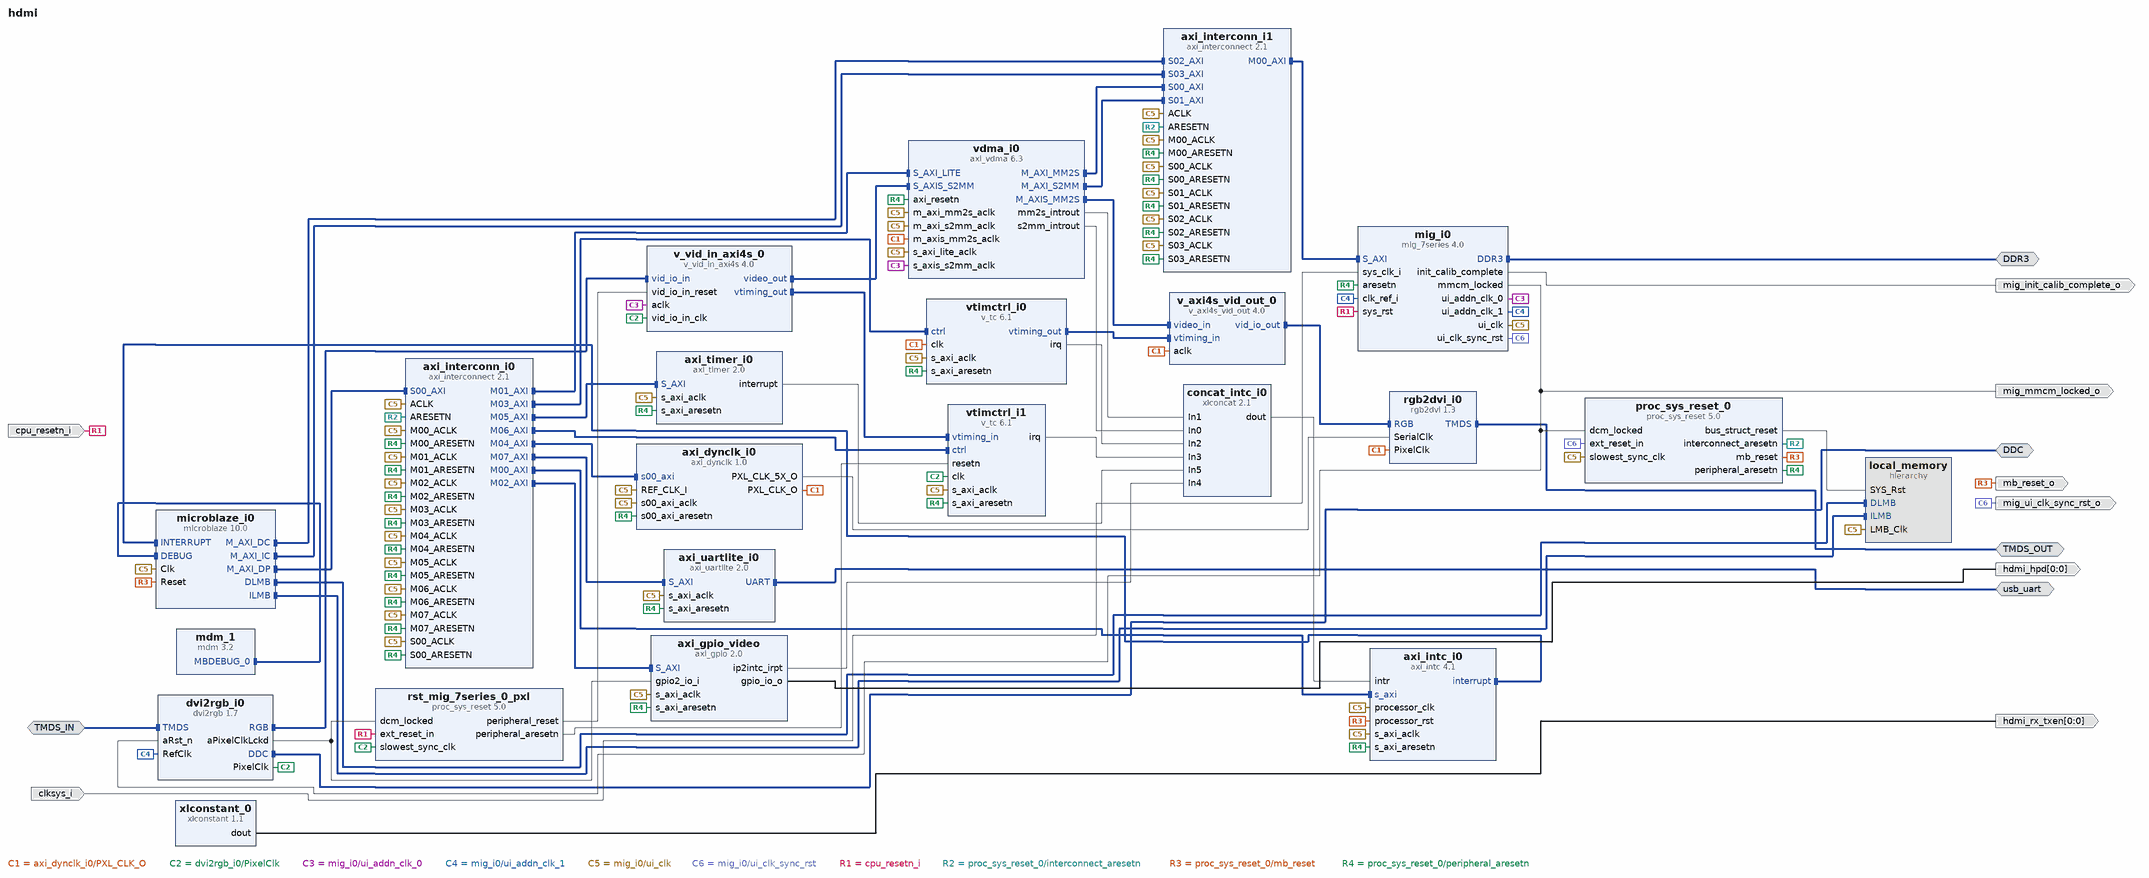
[diagram p0: block diagram of the top level]
# Vivado block design hdmi, xc7a200tsbg484-1, Vivado 2017.4
create_bd_design hdmi

create_bd_intf_port -mode Master -vlnv xilinx.com:interface:iic_rtl:1.0 DDC
create_bd_intf_port -mode Master -vlnv xilinx.com:interface:ddrx_rtl:1.0 DDR3
create_bd_intf_port -mode Slave -vlnv digilentinc.com:interface:tmds_rtl:1.0 TMDS_IN
create_bd_intf_port -mode Master -vlnv digilentinc.com:interface:tmds_rtl:1.0 TMDS_OUT
create_bd_intf_port -mode Master -vlnv xilinx.com:interface:uart_rtl:1.0 usb_uart
create_bd_port -dir O -from 0 -to 0 hdmi_hpd
create_bd_port -dir I -type rst cpu_resetn_i
set_property -dict {CONFIG.POLARITY ACTIVE_LOW} [get_bd_ports cpu_resetn_i]
create_bd_port -dir I -type clk clksys_i
set_property -dict {CONFIG.FREQ_HZ 200000000 CONFIG.PHASE 0.0 CONFIG.CLK_DOMAIN /clk_wiz_0_clk_out1} [get_bd_ports clksys_i]
create_bd_port -dir O -from 0 -to 0 hdmi_rx_txen
create_bd_port -dir O mb_reset_o
create_bd_port -dir O mig_ui_clk_sync_rst_o
create_bd_port -dir O mig_mmcm_locked_o
create_bd_port -dir O mig_init_calib_complete_o

create_bd_cell -type hier local_memory
create_bd_cell -type ip -vlnv digilentinc.com:ip:axi_dynclk:1.0 axi_dynclk_i0
set_property -dict {CONFIG.ADD_BUFMR true} [get_bd_cells axi_dynclk_i0]
create_bd_cell -type ip -vlnv digilentinc.com:ip:dvi2rgb:1.7 dvi2rgb_i0
set_property -dict {CONFIG.kRstActiveHigh false CONFIG.kClkRange 2 CONFIG.kAddBUFG false} [get_bd_cells dvi2rgb_i0]
create_bd_cell -type ip -vlnv digilentinc.com:ip:rgb2dvi:1.3 rgb2dvi_i0
set_property -dict {CONFIG.kRstActiveHigh false CONFIG.kGenerateSerialClk false CONFIG.kClkRange 2} [get_bd_cells rgb2dvi_i0]
create_bd_cell -type ip -vlnv xilinx.com:ip:axi_gpio:2.0 axi_gpio_video
set_property -dict [list \
  CONFIG.C_GPIO_WIDTH 1 \
  CONFIG.C_GPIO2_WIDTH 1 \
  CONFIG.C_IS_DUAL 1 \
  CONFIG.C_ALL_INPUTS_2 1 \
  CONFIG.C_INTERRUPT_PRESENT 1 \
  CONFIG.USE_BOARD_FLOW true \
  CONFIG.GPIO_BOARD_INTERFACE Custom \
  CONFIG.C_ALL_OUTPUTS 1 \
] [get_bd_cells axi_gpio_video]
create_bd_cell -type ip -vlnv xilinx.com:ip:axi_interconnect:2.1 axi_interconn_i1
set_property -dict [list \
  CONFIG.NUM_SI 4 \
  CONFIG.NUM_MI 1 \
  CONFIG.SYNCHRONIZATION_STAGES 2 \
  CONFIG.M00_HAS_REGSLICE 4 \
  CONFIG.M00_HAS_DATA_FIFO 0 \
  CONFIG.S00_HAS_REGSLICE 4 \
  CONFIG.S01_HAS_REGSLICE 4 \
  CONFIG.S02_HAS_REGSLICE 4 \
  CONFIG.S03_HAS_REGSLICE 4 \
  CONFIG.S00_HAS_DATA_FIFO 0 \
  CONFIG.S01_HAS_DATA_FIFO 0 \
  CONFIG.S02_HAS_DATA_FIFO 0 \
  CONFIG.S03_HAS_DATA_FIFO 0 \
] [get_bd_cells axi_interconn_i1]
create_bd_cell -type ip -vlnv xilinx.com:ip:axi_timer:2.0 axi_timer_i0
create_bd_cell -type ip -vlnv xilinx.com:ip:axi_uartlite:2.0 axi_uartlite_i0
set_property -dict [list \
  CONFIG.C_BAUDRATE 115200 \
  CONFIG.USE_BOARD_FLOW true \
  CONFIG.UARTLITE_BOARD_INTERFACE usb_uart \
] [get_bd_cells axi_uartlite_i0]
create_bd_cell -type ip -vlnv xilinx.com:ip:axi_vdma:6.3 vdma_i0
set_property -dict [list \
  CONFIG.c_m_axi_mm2s_data_width 128 \
  CONFIG.c_m_axis_mm2s_tdata_width 24 \
  CONFIG.c_m_axi_s2mm_data_width 128 \
  CONFIG.c_include_s2mm_dre 0 \
  CONFIG.c_mm2s_genlock_mode 0 \
  CONFIG.c_s2mm_genlock_mode 0 \
  CONFIG.c_mm2s_linebuffer_depth 4096 \
  CONFIG.c_s2mm_linebuffer_depth 4096 \
  CONFIG.c_mm2s_max_burst_length 32 \
  CONFIG.c_s2mm_max_burst_length 32 \
  CONFIG.c_include_s2mm 1 \
  CONFIG.c_addr_width 32 \
] [get_bd_cells vdma_i0]
create_bd_cell -type ip -vlnv xilinx.com:ip:mdm:3.2 mdm_1
create_bd_cell -type ip -vlnv xilinx.com:ip:microblaze:10.0 microblaze_i0
set_property -dict [list \
  CONFIG.C_D_AXI 1 \
  CONFIG.C_D_LMB 1 \
  CONFIG.C_I_LMB 1 \
  CONFIG.C_ENABLE_DISCRETE_PORTS 0 \
  CONFIG.G_TEMPLATE_LIST 2 \
  CONFIG.G_USE_EXCEPTIONS 1 \
  CONFIG.C_USE_MSR_INSTR 1 \
  CONFIG.C_USE_PCMP_INSTR 1 \
  CONFIG.C_USE_REORDER_INSTR 1 \
  CONFIG.C_USE_BARREL 1 \
  CONFIG.C_USE_DIV 1 \
  CONFIG.C_USE_HW_MUL 2 \
  CONFIG.C_USE_FPU 2 \
  CONFIG.C_DEBUG_ENABLED 2 \
  CONFIG.C_DEBUG_COUNTER_WIDTH 32 \
  CONFIG.C_USE_ICACHE 1 \
  CONFIG.C_CACHE_BYTE_SIZE 32768 \
  CONFIG.C_ICACHE_LINE_LEN 8 \
  CONFIG.C_ICACHE_VICTIMS 8 \
  CONFIG.C_ICACHE_STREAMS 1 \
  CONFIG.C_ICACHE_DATA_WIDTH 1 \
  CONFIG.C_USE_DCACHE 1 \
  CONFIG.C_DCACHE_BYTE_SIZE 32768 \
  CONFIG.C_DCACHE_LINE_LEN 8 \
  CONFIG.C_DCACHE_USE_WRITEBACK 1 \
  CONFIG.C_DCACHE_VICTIMS 8 \
  CONFIG.C_DCACHE_DATA_WIDTH 1 \
  CONFIG.C_USE_BRANCH_TARGET_CACHE 0 \
] [get_bd_cells microblaze_i0]
create_bd_cell -type ip -vlnv xilinx.com:ip:axi_intc:4.1 axi_intc_i0
set_property -dict {CONFIG.C_HAS_FAST 1} [get_bd_cells axi_intc_i0]
create_bd_cell -type ip -vlnv xilinx.com:ip:axi_interconnect:2.1 axi_interconn_i0
set_property -dict {CONFIG.NUM_MI 8 CONFIG.SYNCHRONIZATION_STAGES 2} [get_bd_cells axi_interconn_i0]
create_bd_cell -type ip -vlnv xilinx.com:ip:xlconcat:2.1 concat_intc_i0
set_property -dict {CONFIG.NUM_PORTS 6 CONFIG.dout_width 6} [get_bd_cells concat_intc_i0]
create_bd_cell -type ip -vlnv xilinx.com:ip:mig_7series:4.0 mig_i0
set_property -dict [list \
  CONFIG.XML_INPUT_FILE mig_b.prj \
  CONFIG.RESET_BOARD_INTERFACE reset \
  CONFIG.MIG_DONT_TOUCH_PARAM Custom \
  CONFIG.BOARD_MIG_PARAM Custom \
] [get_bd_cells mig_i0]
create_bd_cell -type ip -vlnv xilinx.com:ip:proc_sys_reset:5.0 rst_mig_7series_0_pxl
set_property -dict [list \
  CONFIG.C_AUX_RESET_HIGH 0 \
  CONFIG.USE_BOARD_FLOW true \
  CONFIG.RESET_BOARD_INTERFACE Custom \
] [get_bd_cells rst_mig_7series_0_pxl]
create_bd_cell -type ip -vlnv xilinx.com:ip:v_axi4s_vid_out:4.0 v_axi4s_vid_out_0
set_property -dict [list \
  CONFIG.C_S_AXIS_VIDEO_FORMAT 2 \
  CONFIG.C_S_AXIS_VIDEO_DATA_WIDTH 8 \
  CONFIG.C_ADDR_WIDTH 5 \
  CONFIG.C_VTG_MASTER_SLAVE 1 \
] [get_bd_cells v_axi4s_vid_out_0]
create_bd_cell -type ip -vlnv xilinx.com:ip:v_tc:6.1 vtimctrl_i0
set_property -dict {CONFIG.enable_detection false} [get_bd_cells vtimctrl_i0]
create_bd_cell -type ip -vlnv xilinx.com:ip:v_tc:6.1 vtimctrl_i1
set_property -dict [list \
  CONFIG.HAS_INTC_IF true \
  CONFIG.max_lines_per_frame 2048 \
  CONFIG.horizontal_blank_detection false \
  CONFIG.enable_generation false \
  CONFIG.vertical_blank_detection false \
] [get_bd_cells vtimctrl_i1]
create_bd_cell -type ip -vlnv xilinx.com:ip:v_vid_in_axi4s:4.0 v_vid_in_axi4s_0
set_property -dict {CONFIG.C_HAS_ASYNC_CLK 1 CONFIG.C_ADDR_WIDTH 5} [get_bd_cells v_vid_in_axi4s_0]
create_bd_cell -type ip -vlnv xilinx.com:ip:xlconstant:1.1 xlconstant_0
create_bd_cell -type ip -vlnv xilinx.com:ip:proc_sys_reset:5.0 proc_sys_reset_0

# ---- hierarchy /local_memory ----
current_bd_instance /local_memory
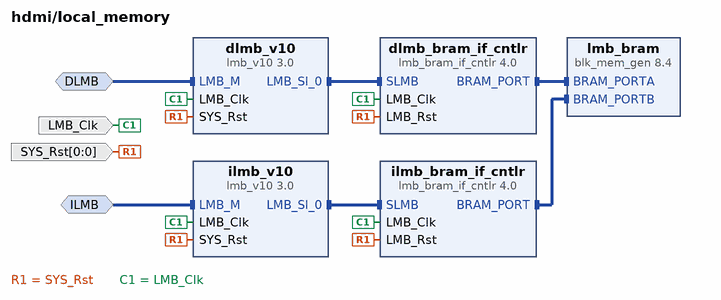
[diagram p1: block diagram inside /local_memory]
create_bd_intf_pin -mode MirroredMaster -vlnv xilinx.com:interface:lmb_rtl:1.0 DLMB
create_bd_intf_pin -mode MirroredMaster -vlnv xilinx.com:interface:lmb_rtl:1.0 ILMB
create_bd_pin -dir I -type clk LMB_Clk
create_bd_pin -dir I -from 0 -to 0 -type rst SYS_Rst

create_bd_cell -type ip -vlnv xilinx.com:ip:lmb_v10:3.0 dlmb_v10
create_bd_cell -type ip -vlnv xilinx.com:ip:lmb_v10:3.0 ilmb_v10
create_bd_cell -type ip -vlnv xilinx.com:ip:lmb_bram_if_cntlr:4.0 dlmb_bram_if_cntlr
set_property -dict {CONFIG.C_ECC 0} [get_bd_cells dlmb_bram_if_cntlr]
create_bd_cell -type ip -vlnv xilinx.com:ip:lmb_bram_if_cntlr:4.0 ilmb_bram_if_cntlr
set_property -dict {CONFIG.C_ECC 0} [get_bd_cells ilmb_bram_if_cntlr]
create_bd_cell -type ip -vlnv xilinx.com:ip:blk_mem_gen:8.4 lmb_bram
set_property -dict [list \
  CONFIG.Memory_Type True_Dual_Port_RAM \
  CONFIG.Enable_B Use_ENB_Pin \
  CONFIG.Use_RSTB_Pin true \
  CONFIG.Port_B_Clock 100 \
  CONFIG.Port_B_Write_Rate 50 \
  CONFIG.Port_B_Enable_Rate 100 \
  CONFIG.use_bram_block BRAM_Controller \
  CONFIG.EN_SAFETY_CKT false \
] [get_bd_cells lmb_bram]

# ---- connections ----

current_bd_instance /local_memory
connect_bd_intf_net -intf_net microblaze_0_dlmb_bus [get_bd_intf_pins dlmb_bram_if_cntlr/SLMB] [get_bd_intf_pins dlmb_v10/LMB_Sl_0]
connect_bd_intf_net -intf_net microblaze_0_dlmb_cntlr [get_bd_intf_pins dlmb_bram_if_cntlr/BRAM_PORT] [get_bd_intf_pins lmb_bram/BRAM_PORTA]
connect_bd_intf_net -intf_net microblaze_0_ilmb_bus [get_bd_intf_pins ilmb_bram_if_cntlr/SLMB] [get_bd_intf_pins ilmb_v10/LMB_Sl_0]
connect_bd_intf_net -intf_net microblaze_0_ilmb_cntlr [get_bd_intf_pins ilmb_bram_if_cntlr/BRAM_PORT] [get_bd_intf_pins lmb_bram/BRAM_PORTB]
connect_bd_intf_net -intf_net microblaze_0_dlmb [get_bd_intf_pins DLMB] [get_bd_intf_pins dlmb_v10/LMB_M]
connect_bd_intf_net -intf_net microblaze_0_ilmb [get_bd_intf_pins ILMB] [get_bd_intf_pins ilmb_v10/LMB_M]
connect_bd_net [get_bd_pins SYS_Rst] \
  [get_bd_pins dlmb_v10/SYS_Rst] [get_bd_pins ilmb_v10/SYS_Rst] [get_bd_pins dlmb_bram_if_cntlr/LMB_Rst] \
  [get_bd_pins ilmb_bram_if_cntlr/LMB_Rst]
connect_bd_net -net microblaze_0_Clk [get_bd_pins LMB_Clk] \
  [get_bd_pins dlmb_v10/LMB_Clk] [get_bd_pins ilmb_v10/LMB_Clk] [get_bd_pins dlmb_bram_if_cntlr/LMB_Clk] \
  [get_bd_pins ilmb_bram_if_cntlr/LMB_Clk]

current_bd_instance /
connect_bd_intf_net -intf_net axi_mem_intercon_M00_AXI [get_bd_intf_pins axi_interconn_i1/M00_AXI] [get_bd_intf_pins mig_i0/S_AXI]
connect_bd_intf_net -intf_net axi_vdma_0_M_AXIS_MM2S [get_bd_intf_pins vdma_i0/M_AXIS_MM2S] [get_bd_intf_pins v_axi4s_vid_out_0/video_in]
connect_bd_intf_net -intf_net axi_vdma_0_M_AXI_MM2S [get_bd_intf_pins axi_interconn_i1/S00_AXI] [get_bd_intf_pins vdma_i0/M_AXI_MM2S]
connect_bd_intf_net -intf_net axi_vdma_0_M_AXI_S2MM [get_bd_intf_pins axi_interconn_i1/S01_AXI] [get_bd_intf_pins vdma_i0/M_AXI_S2MM]
connect_bd_intf_net -intf_net dvi2rgb_0_RGB [get_bd_intf_pins dvi2rgb_i0/RGB] [get_bd_intf_pins v_vid_in_axi4s_0/vid_io_in]
connect_bd_intf_net -intf_net microblaze_0_M_AXI_DC [get_bd_intf_pins axi_interconn_i1/S02_AXI] [get_bd_intf_pins microblaze_i0/M_AXI_DC]
connect_bd_intf_net -intf_net microblaze_0_M_AXI_IC [get_bd_intf_pins axi_interconn_i1/S03_AXI] [get_bd_intf_pins microblaze_i0/M_AXI_IC]
connect_bd_intf_net -intf_net microblaze_0_axi_dp [get_bd_intf_pins microblaze_i0/M_AXI_DP] [get_bd_intf_pins axi_interconn_i0/S00_AXI]
connect_bd_intf_net [get_bd_intf_pins vdma_i0/S_AXI_LITE] [get_bd_intf_pins axi_interconn_i0/M01_AXI]
connect_bd_intf_net [get_bd_intf_pins axi_gpio_video/S_AXI] [get_bd_intf_pins axi_interconn_i0/M02_AXI]
connect_bd_intf_net [get_bd_intf_pins axi_interconn_i0/M03_AXI] [get_bd_intf_pins vtimctrl_i0/ctrl]
connect_bd_intf_net [get_bd_intf_pins axi_dynclk_i0/s00_axi] [get_bd_intf_pins axi_interconn_i0/M04_AXI]
connect_bd_intf_net [get_bd_intf_pins axi_timer_i0/S_AXI] [get_bd_intf_pins axi_interconn_i0/M05_AXI]
connect_bd_intf_net [get_bd_intf_pins axi_interconn_i0/M06_AXI] [get_bd_intf_pins vtimctrl_i1/ctrl]
connect_bd_intf_net [get_bd_intf_pins axi_uartlite_i0/S_AXI] [get_bd_intf_pins axi_interconn_i0/M07_AXI]
connect_bd_intf_net -intf_net microblaze_0_debug [get_bd_intf_pins mdm_1/MBDEBUG_0] [get_bd_intf_pins microblaze_i0/DEBUG]
connect_bd_intf_net -intf_net microblaze_0_dlmb_1 [get_bd_intf_pins microblaze_i0/DLMB] [get_bd_intf_pins local_memory/DLMB]
connect_bd_intf_net -intf_net microblaze_0_ilmb_1 [get_bd_intf_pins microblaze_i0/ILMB] [get_bd_intf_pins local_memory/ILMB]
connect_bd_intf_net -intf_net microblaze_0_intc_axi [get_bd_intf_pins axi_intc_i0/s_axi] [get_bd_intf_pins axi_interconn_i0/M00_AXI]
connect_bd_intf_net -intf_net microblaze_0_interrupt [get_bd_intf_pins microblaze_i0/INTERRUPT] [get_bd_intf_pins axi_intc_i0/interrupt]
connect_bd_intf_net [get_bd_intf_pins rgb2dvi_i0/RGB] [get_bd_intf_pins v_axi4s_vid_out_0/vid_io_out]
connect_bd_intf_net -intf_net v_tc_0_vtiming_out [get_bd_intf_pins v_axi4s_vid_out_0/vtiming_in] [get_bd_intf_pins vtimctrl_i0/vtiming_out]
connect_bd_intf_net [get_bd_intf_pins vdma_i0/S_AXIS_S2MM] [get_bd_intf_pins v_vid_in_axi4s_0/video_out]
connect_bd_intf_net [get_bd_intf_pins vtimctrl_i1/vtiming_in] [get_bd_intf_pins v_vid_in_axi4s_0/vtiming_out]
connect_bd_intf_net -intf_net dvi2rgb_0_DDC [get_bd_intf_ports DDC] [get_bd_intf_pins dvi2rgb_i0/DDC]
connect_bd_intf_net -intf_net mig_7series_0_DDR3 [get_bd_intf_ports DDR3] [get_bd_intf_pins mig_i0/DDR3]
connect_bd_intf_net [get_bd_intf_ports TMDS_IN] [get_bd_intf_pins dvi2rgb_i0/TMDS]
connect_bd_intf_net -intf_net rgb2dvi_0_TMDS [get_bd_intf_ports TMDS_OUT] [get_bd_intf_pins rgb2dvi_i0/TMDS]
connect_bd_intf_net -intf_net axi_uartlite_0_UART [get_bd_intf_ports usb_uart] [get_bd_intf_pins axi_uartlite_i0/UART]
connect_bd_net -net axi_dynclk_0_PXL_CLK_5X_O [get_bd_pins axi_dynclk_i0/PXL_CLK_5X_O] [get_bd_pins rgb2dvi_i0/SerialClk]
connect_bd_net -net axi_dynclk_0_PXL_CLK_O [get_bd_pins axi_dynclk_i0/PXL_CLK_O] \
  [get_bd_pins rgb2dvi_i0/PixelClk] [get_bd_pins vdma_i0/m_axis_mm2s_aclk] [get_bd_pins v_axi4s_vid_out_0/aclk] \
  [get_bd_pins vtimctrl_i0/clk]
connect_bd_net [get_bd_pins axi_gpio_video/gpio_io_o] [get_bd_ports hdmi_hpd]
connect_bd_net [get_bd_pins axi_gpio_video/ip2intc_irpt] [get_bd_pins concat_intc_i0/In4]
connect_bd_net -net axi_timer_0_interrupt [get_bd_pins axi_timer_i0/interrupt] [get_bd_pins concat_intc_i0/In5]
connect_bd_net -net axi_vdma_0_mm2s_introut [get_bd_pins vdma_i0/mm2s_introut] [get_bd_pins concat_intc_i0/In1]
connect_bd_net -net axi_vdma_0_s2mm_introut [get_bd_pins vdma_i0/s2mm_introut] [get_bd_pins concat_intc_i0/In0]
connect_bd_net -net dvi2rgb_0_PixelClk [get_bd_pins dvi2rgb_i0/PixelClk] \
  [get_bd_pins rst_mig_7series_0_pxl/slowest_sync_clk] [get_bd_pins vtimctrl_i1/clk] \
  [get_bd_pins v_vid_in_axi4s_0/vid_io_in_clk]
connect_bd_net -net dvi2rgb_0_aPixelClkLckd [get_bd_pins dvi2rgb_i0/aPixelClkLckd] \
  [get_bd_pins axi_gpio_video/gpio2_io_i] [get_bd_pins rst_mig_7series_0_pxl/dcm_locked]
connect_bd_net -net microblaze_0_intr [get_bd_pins concat_intc_i0/dout] [get_bd_pins axi_intc_i0/intr]
connect_bd_net -net mig_7series_0_mmcm_locked [get_bd_pins mig_i0/mmcm_locked] \
  [get_bd_pins dvi2rgb_i0/aRst_n] [get_bd_ports mig_mmcm_locked_o] [get_bd_pins proc_sys_reset_0/dcm_locked]
connect_bd_net -net mig_7series_0_ui_addn_clk_0 [get_bd_pins mig_i0/ui_addn_clk_0] \
  [get_bd_pins vdma_i0/s_axis_s2mm_aclk] [get_bd_pins v_vid_in_axi4s_0/aclk]
connect_bd_net -net mig_7series_0_ui_addn_clk_2 [get_bd_pins mig_i0/ui_addn_clk_1] [get_bd_pins dvi2rgb_i0/RefClk] [get_bd_pins mig_i0/clk_ref_i]
connect_bd_net -net mig_7series_0_ui_clk [get_bd_pins mig_i0/ui_clk] \
  [get_bd_pins axi_dynclk_i0/REF_CLK_I] [get_bd_pins axi_dynclk_i0/s00_axi_aclk] [get_bd_pins axi_gpio_video/s_axi_aclk] \
  [get_bd_pins axi_timer_i0/s_axi_aclk] [get_bd_pins axi_uartlite_i0/s_axi_aclk] [get_bd_pins vdma_i0/s_axi_lite_aclk] \
  [get_bd_pins vdma_i0/m_axi_mm2s_aclk] [get_bd_pins vdma_i0/m_axi_s2mm_aclk] [get_bd_pins microblaze_i0/Clk] \
  [get_bd_pins axi_intc_i0/s_axi_aclk] [get_bd_pins axi_intc_i0/processor_clk] [get_bd_pins vtimctrl_i0/s_axi_aclk] \
  [get_bd_pins vtimctrl_i1/s_axi_aclk] [get_bd_pins local_memory/LMB_Clk] [get_bd_pins axi_interconn_i1/ACLK] \
  [get_bd_pins axi_interconn_i1/S00_ACLK] [get_bd_pins axi_interconn_i1/S01_ACLK] [get_bd_pins axi_interconn_i1/S02_ACLK] \
  [get_bd_pins axi_interconn_i1/S03_ACLK] [get_bd_pins axi_interconn_i1/M00_ACLK] [get_bd_pins axi_interconn_i0/ACLK] \
  [get_bd_pins axi_interconn_i0/S00_ACLK] [get_bd_pins axi_interconn_i0/M00_ACLK] [get_bd_pins axi_interconn_i0/M01_ACLK] \
  [get_bd_pins axi_interconn_i0/M02_ACLK] [get_bd_pins axi_interconn_i0/M03_ACLK] [get_bd_pins axi_interconn_i0/M04_ACLK] \
  [get_bd_pins axi_interconn_i0/M05_ACLK] [get_bd_pins axi_interconn_i0/M06_ACLK] [get_bd_pins axi_interconn_i0/M07_ACLK] \
  [get_bd_pins proc_sys_reset_0/slowest_sync_clk]
connect_bd_net -net mig_7series_0_ui_clk_sync_rst [get_bd_pins mig_i0/ui_clk_sync_rst] \
  [get_bd_ports mig_ui_clk_sync_rst_o] [get_bd_pins proc_sys_reset_0/ext_reset_in]
connect_bd_net -net rstsys_i [get_bd_ports cpu_resetn_i] [get_bd_pins mig_i0/sys_rst] [get_bd_pins rst_mig_7series_0_pxl/ext_reset_in]
connect_bd_net -net rst_mig_7series_0_100M_interconnect_aresetn [get_bd_pins proc_sys_reset_0/interconnect_aresetn] \
  [get_bd_pins axi_interconn_i1/ARESETN] [get_bd_pins axi_interconn_i0/ARESETN]
connect_bd_net -net rst_mig_7series_0_100M_mb_reset [get_bd_pins proc_sys_reset_0/mb_reset] \
  [get_bd_pins microblaze_i0/Reset] [get_bd_pins axi_intc_i0/processor_rst] [get_bd_ports mb_reset_o]
connect_bd_net -net rst_mig_7series_0_100M_peripheral_aresetn [get_bd_pins proc_sys_reset_0/peripheral_aresetn] \
  [get_bd_pins axi_dynclk_i0/s00_axi_aresetn] [get_bd_pins axi_gpio_video/s_axi_aresetn] \
  [get_bd_pins axi_timer_i0/s_axi_aresetn] [get_bd_pins axi_uartlite_i0/s_axi_aresetn] [get_bd_pins vdma_i0/axi_resetn] \
  [get_bd_pins axi_intc_i0/s_axi_aresetn] [get_bd_pins mig_i0/aresetn] [get_bd_pins vtimctrl_i0/s_axi_aresetn] \
  [get_bd_pins vtimctrl_i1/s_axi_aresetn] [get_bd_pins axi_interconn_i1/S00_ARESETN] \
  [get_bd_pins axi_interconn_i1/S01_ARESETN] [get_bd_pins axi_interconn_i1/S02_ARESETN] \
  [get_bd_pins axi_interconn_i1/S03_ARESETN] [get_bd_pins axi_interconn_i1/M00_ARESETN] \
  [get_bd_pins axi_interconn_i0/S00_ARESETN] [get_bd_pins axi_interconn_i0/M00_ARESETN] \
  [get_bd_pins axi_interconn_i0/M01_ARESETN] [get_bd_pins axi_interconn_i0/M02_ARESETN] \
  [get_bd_pins axi_interconn_i0/M03_ARESETN] [get_bd_pins axi_interconn_i0/M04_ARESETN] \
  [get_bd_pins axi_interconn_i0/M05_ARESETN] [get_bd_pins axi_interconn_i0/M06_ARESETN] \
  [get_bd_pins axi_interconn_i0/M07_ARESETN]
connect_bd_net [get_bd_pins rst_mig_7series_0_pxl/peripheral_aresetn] [get_bd_pins vtimctrl_i1/resetn]
connect_bd_net [get_bd_pins rst_mig_7series_0_pxl/peripheral_reset] [get_bd_pins v_vid_in_axi4s_0/vid_io_in_reset]
connect_bd_net [get_bd_ports clksys_i] [get_bd_pins mig_i0/sys_clk_i]
connect_bd_net -net v_tc_0_irq [get_bd_pins vtimctrl_i0/irq] [get_bd_pins concat_intc_i0/In2]
connect_bd_net -net v_tc_1_irq [get_bd_pins vtimctrl_i1/irq] [get_bd_pins concat_intc_i0/In3]
connect_bd_net [get_bd_pins xlconstant_0/dout] [get_bd_ports hdmi_rx_txen]
connect_bd_net [get_bd_pins mig_i0/init_calib_complete] [get_bd_ports mig_init_calib_complete_o]
connect_bd_net [get_bd_pins proc_sys_reset_0/bus_struct_reset] [get_bd_pins local_memory/SYS_Rst]

# ---- address map ----
assign_bd_address -offset 0x00000000 -range 32K -target_address_space [get_bd_addr_spaces microblaze_i0/Data] [get_bd_addr_segs local_memory/dlmb_bram_if_cntlr/SLMB/Mem]
assign_bd_address -offset 0x40000000 -range 64K -target_address_space [get_bd_addr_spaces microblaze_i0/Data] [get_bd_addr_segs axi_gpio_video/S_AXI/Reg]
assign_bd_address -offset 0x40600000 -range 64K -target_address_space [get_bd_addr_spaces microblaze_i0/Data] [get_bd_addr_segs axi_uartlite_i0/S_AXI/Reg]
assign_bd_address -offset 0x41200000 -range 64K -target_address_space [get_bd_addr_spaces microblaze_i0/Data] [get_bd_addr_segs axi_intc_i0/S_AXI/Reg]
assign_bd_address -offset 0x41C00000 -range 64K -target_address_space [get_bd_addr_spaces microblaze_i0/Data] [get_bd_addr_segs axi_timer_i0/S_AXI/Reg]
assign_bd_address -offset 0x44A00000 -range 64K -target_address_space [get_bd_addr_spaces microblaze_i0/Data] [get_bd_addr_segs vdma_i0/S_AXI_LITE/Reg]
assign_bd_address -offset 0x44A10000 -range 64K -target_address_space [get_bd_addr_spaces microblaze_i0/Data] [get_bd_addr_segs vtimctrl_i0/ctrl/Reg]
assign_bd_address -offset 0x44A20000 -range 64K -target_address_space [get_bd_addr_spaces microblaze_i0/Data] [get_bd_addr_segs axi_dynclk_i0/s00_axi/reg0]
assign_bd_address -offset 0x44A30000 -range 64K -target_address_space [get_bd_addr_spaces microblaze_i0/Data] [get_bd_addr_segs vtimctrl_i1/ctrl/Reg]
assign_bd_address -offset 0x80000000 -range 512M -target_address_space [get_bd_addr_spaces microblaze_i0/Data] [get_bd_addr_segs mig_i0/memmap/memaddr]
assign_bd_address -offset 0x00000000 -range 32K -target_address_space [get_bd_addr_spaces microblaze_i0/Instruction] [get_bd_addr_segs local_memory/ilmb_bram_if_cntlr/SLMB/Mem]
assign_bd_address -offset 0x80000000 -range 512M -target_address_space [get_bd_addr_spaces microblaze_i0/Instruction] [get_bd_addr_segs mig_i0/memmap/memaddr]
assign_bd_address -offset 0x80000000 -range 512M -target_address_space [get_bd_addr_spaces vdma_i0/Data_MM2S] [get_bd_addr_segs mig_i0/memmap/memaddr]
assign_bd_address -offset 0x80000000 -range 512M -target_address_space [get_bd_addr_spaces vdma_i0/Data_S2MM] [get_bd_addr_segs mig_i0/memmap/memaddr]

validate_bd_design
save_bd_design
